# Altium schematic sheet ultrasound module1.0 - 改.SchDoc
size A4
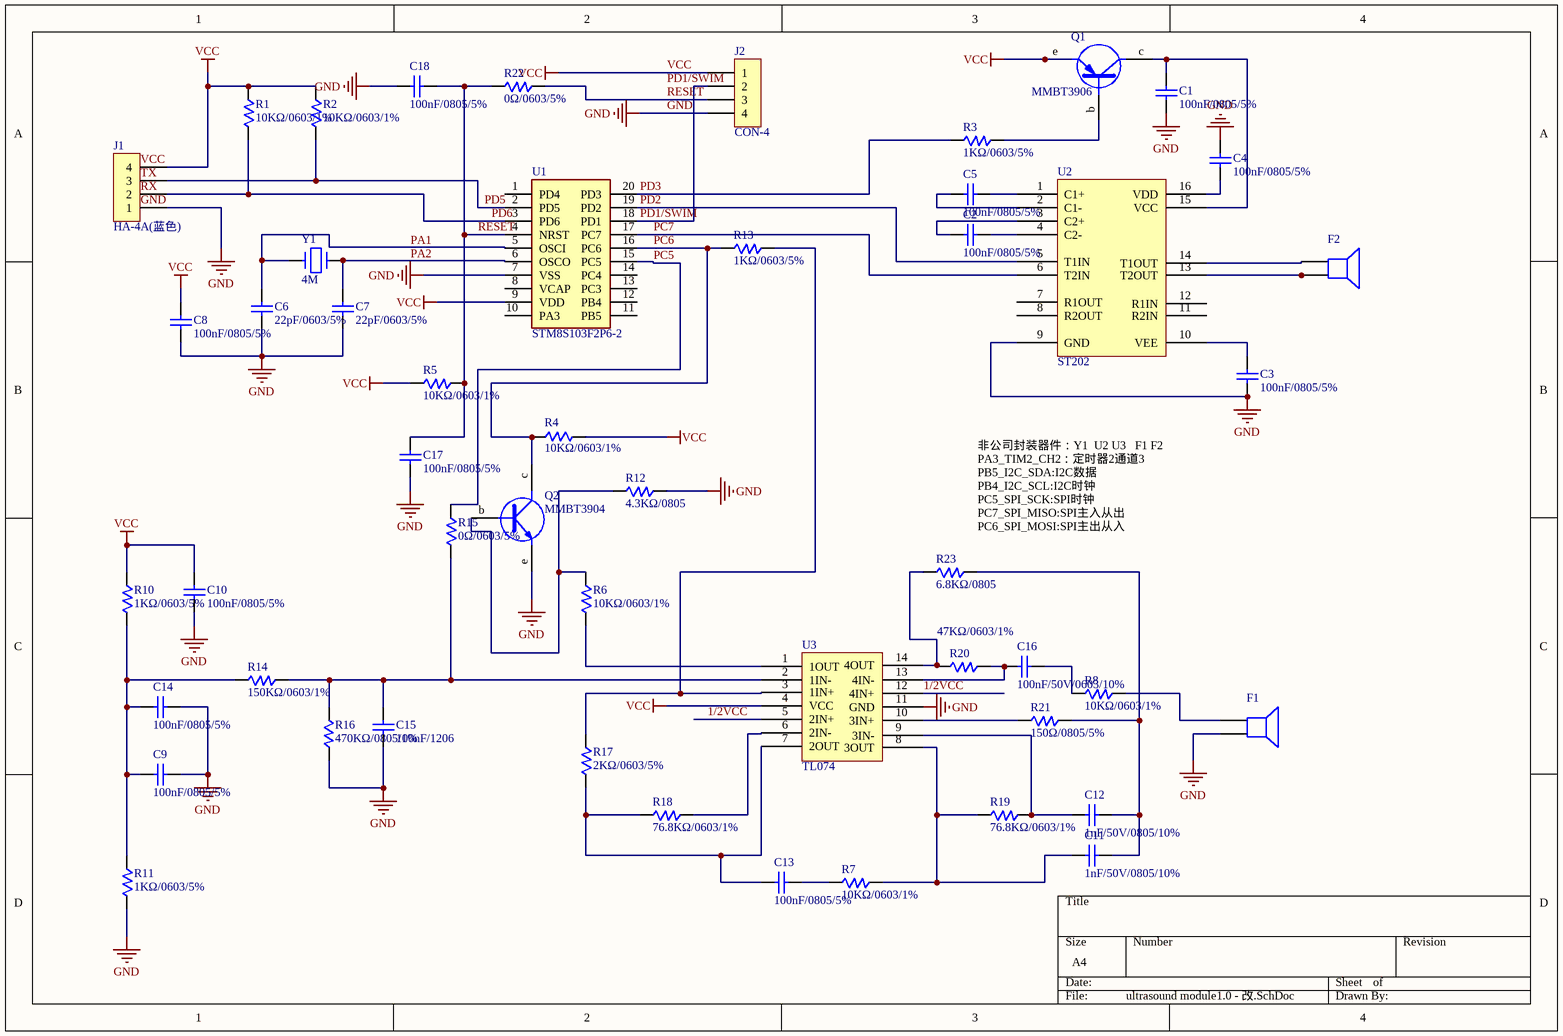
[diagram p0: ultrasound module1.0 - 改.SchDoc]

## Parts
C1  100nF/0805/5%  [0805C]
C2  100nF/0805/5%  [0805C]
C3  100nF/0805/5%  [0805C]
C4  100nF/0805/5%  [0805C]
C5  100nF/0805/5%  [0805C]
C6  22pF/0603/5%  [0603C]
C7  22pF/0603/5%  [0603C]
C8  100nF/0805/5%  [0805C]
C9  100nF/0805/5%  [0805C]
C10  100nF/0805/5%  [0805C]
C11  1nF/50V/0805/10%  [0805C]
C12  1nF/50V/0805/10%  [0805C]
C13  100nF/0805/5%  [0805C]
C14  100nF/0805/5%  [0805C]
C15  100nF/1206  [1206C]
C16  100nF/50V/0603/10%  [0603C]
C17  100nF/0805/5%  [0805C]
C18  100nF/0805/5%  [0805C]
F1  Speaker  [PIN2]  (value not drawn)
F2  Speaker  [PIN2]  (value not drawn)
J1  HA-4A(蓝色)  [HA-4A]
J2  CON-4  [HA-4A]
Q1  MMBT3906  [SOT-23B]
Q2  MMBT3904  [SOT-23B]
R1  10KΩ/0603/1%  [0603]
R2  10KΩ/0603/1%  [0603]
R3  1KΩ/0603/5%  [0603]
R4  10KΩ/0603/1%  [0603]
R5  10KΩ/0603/1%  [0603]
R6  10KΩ/0603/1%  [0603]
R7  10KΩ/0603/1%  [0603]
R8  10KΩ/0603/1%  [0603]
R10  1KΩ/0603/5%  [0603]
R11  1KΩ/0603/5%  [0603]
R12  4.3KΩ/0805  [0805]
R13  1KΩ/0603/5%  [0603]
R14  150KΩ/0603/1%  [0603]
R15  0Ω/0603/5%  [0603]
R16  470KΩ/0805/1%  [0805]
R17  2KΩ/0603/5%  [0603]
R18  76.8KΩ/0603/1%  [0603]
R19  76.8KΩ/0603/1%  [0603]
R20  47KΩ/0603/1%  [0603]
R21  150Ω/0805/5%  [0805]
R22  0Ω/0603/5%  [0603]
R23  6.8KΩ/0805  [0805]
U1  STM8S103F2P6-2  [TSSOP20]
U2  ST202  [ST202]
U3  TL074  [TL074]
Y1  4M  [SMD-49]

## Nets
GND: C1.1 C3.1 C4.2 C6.1 C7.1 C8.1 C9.1 C10.1 C14.1 C15.1 C17.1 C18.2 F1.2 J1.1 J2.4 Q2.e R11.1 R12.2 R16.2 U1.7(VSS) U2.9(GND) U3.11(GND)
VCC: C8.2 C10.2 J1.4 J2.1 Q1.e R1.2 R2.2 R4.1 R5.1 R10.2 U1.9(VDD) U3.4(VCC)
1/2VCC: U3.5(2IN+) U3.12(4IN+)
PC5: R15.2 U1.15(PC5)
PC6: Q2.c R4.2 R13.1 U1.16(PC6)
PC7: U1.17(PC7) U2.6(T2IN)
PD1/SWIM: J2.2 U1.18(PD1)
PD2: U1.19(PD2) U2.5(T1IN)
PD3: R3.1 U1.20(PD3)
PD5: J1.3 R2.1 U1.2(PD5)
PD6: J1.2 R1.1 U1.3(PD6)
RESET: C17.2 C18.1 J2.3 R5.2 R22.1 R22.2 U1.4(NRST)
NetC1_2: C1.2 Q1.c U2.15(VCC)
NetC2_1: C2.1 U2.3(C2+)
NetC2_2: C2.2 U2.4(C2-)
NetC3_2: C3.2 U2.10(VEE)
NetC4_1: C4.1 U2.16(VDD)
NetC5_1: C5.1 U2.2(C1-)
NetC5_2: C5.2 U2.1(C1+)
NetC6_2: C6.2 U1.5(OSCI) Y1.1
NetC7_2: C7.2 U1.6(OSCO) Y1.2
NetC9_2: C9.2 C14.2 R10.1 R11.2 R14.1
NetC11_1: C11.1 R7.2 R19.1 U3.8(3OUT)
NetC11_2: C11.2 C12.2 R21.2 R23.2
NetC12_1: C12.1 R19.2 U3.9(3IN-)
NetC13_1: C13.1 R17.1 R18.1 U3.7(2OUT)
NetC13_2: C13.2 R7.1
NetC15_2: C15.2 R14.2 R15.1 R16.1 U3.2(1IN-)
NetC16_1: C16.1 R8.1
NetC16_2: C16.2 R20.2 U3.13(4IN-)
NetF1_1: F1.1 R8.2
NetF2_1: F2.1 U2.14(T1OUT)
NetF2_2: F2.2 U2.13(T2OUT)
NetQ1_b: Q1.b R3.2
NetQ2_b: Q2.b R6.2 R12.1
NetR6_1: R6.1 U3.1(1OUT)
NetR13_2: R13.2 R17.2 U3.3(1IN+)
NetR18_2: R18.2 U3.6(2IN-)
NetR20_1: R20.1 R23.1 U3.14(4OUT)
NetR21_1: R21.1 U3.10(3IN+)

Not connected (* = marked no-connect by the designer): U1 1(PD4) 8(VCAP) 10(PA3) 11(PB5) 12(PB4) 13(PC3) 14(PC4); U2 7(R1OUT) 8(R2OUT) 11(R2IN) 12(R1IN); Y1 3(GND)

## Notes on the sheet
- (near R23) 非公司封装器件：Y1  U2 U3   F1 F2
  PA3_TIM2_CH2：定时器2通道3
  PB5_I2C_SDA:I2C数据
  PB4_I2C_SCL:I2C时钟
  PC5_SPI_SCK:SPI时钟
  PC7_SPI_MISO:SPI主入从出
  PC6_SPI_MOSI:SPI主出从入
- Labels drawn without touching a wire or pin: GND, PA1, PA2, PD1/SWIM, RX, TX, VCC

## Library data of the parts
C1-C5 C8-C10 C13 C14 C17 C18 = 贴片电容104J/100nF/50V/0805封装/5%/X7R/环保: 物料名称: 贴片电容104J/50V/0805封装/5%/X7R/环保; 物料编号: 1.01.25.002; 领料单位: 电子车间; 单位: 个; 仓库/库位: 内5X
C6 C7 = 贴片电容22PF/0603封装/精度5%/NPO/环保: 物料编号: 1.01.21.132; 领料单位: 电子车间; 单位: 个; 仓库/库位: 内5X; 物料名称: 贴片电容22PF/0603封装/精度5%/NPO/环保
C11 C12 = 贴片电容102/1nF/50V/0805封装/10%/N7R/环保: 物料名称: 贴片电容102/50V/0805封装/10%/N7R/环保; 物料编号: 1.01.25.020; 领料单位: 电子车间; 单位: 个; 仓库/库位: 内5X
C15 = 贴片电容104/100nF/1206封装/环保: 物料名称: 贴片电容104/1206封装/环保; 物料编号: 1.01.25.014; 领料单位: 电子车间; 单位: 个; 仓库/库位: 内5X
C16 = 贴片电容100nF（104M）/50V/0603封装/10%/X7R/环保: 物料编号: 1.01.25.056; 领料单位: 电子车间; 单位: 个; 仓库/库位: 内5X; 物料名称: 贴片电容100nF（104M）/50V/0603封装/10%/X7R/环保
F1 F2 = Speaker: Loudspeaker; Published: 24-Mar-1999; LatestRevisionDate: 17-Jul-2002; LatestRevisionNote: Re-released for DXP Platform.; PackageReference: PIN2; Publisher: Altium Limited
J1 = 带勾小直脚HA-4A(蓝色)/环保: 物料编号: 1.01.57.892; 领料单位: 电子车间; 单位: 个; 仓库/库位: 内5X; 物料名称: 带勾小直脚HA-4A(蓝色)/环保
J2 = 带勾小直脚HA-4A(白色)/环保: 物料编号: 1.01.57.884; 领料单位: 电子车间; 单位: 个; 仓库/库位: 内5X; 物料名称: 带勾小直脚HA-4A(白色)/环保
Q1 = 贴片三极管MMBT3906/sot-23/环保: 物料名称: 贴片三极管/MMBT3906/sot-23/环保; 物料编号: 1.01.33.012; 领料单位: 电子车间; 单位: 个; 仓库/库位: 内5X
Q2 = 贴片三极管1AM/MMBT3904/sot-23封装环保: 物料编号: 1.01.33.013; 领料单位: 电子车间; 单位: 个; 仓库/库位: 内5X; 物料名称: 贴片三极管1AM/MMBT3904/sot-23封装环保
R1 R2 R4-R8 = 贴片电阻10kΩ(1%)/0603封装/环保: 物料编号: 1.01.15.112; 领料单位: 电子车间; 单位: 个; 仓库/库位: 内5X; 物料名称: 贴片电阻10kΩ(1%)/0603封装/环保
R3 R10 R11 R13 = 贴片电阻1K/(5%)/0603封装/环保: 物料编号: 1.01.15.111; 领料单位: 电子车间; 单位: 个; 仓库/库位: 内5X; 物料名称: 贴片电阻1K/(5%)/0603封装/环保
R12 = 贴片电阻4.3KΩ/0805封装/环保: 物料编号: 1.01.15.053; 领料单位: 电子车间; 单位: 个; 仓库/库位: 内5X; 物料名称: 贴片电阻4.3KΩ/0805封装/环保
R14 = 贴片电阻150kΩ(1%)/0603封装/环保: 物料编号: 1.01.15.125; 领料单位: 电子车间; 单位: 个; 仓库/库位: 内5X; 物料名称: 贴片电阻150kΩ(1%)/0603封装/环保
R15 R22 = 贴片电阻0Ω/(5%)/0603封装/环保: 物料编号: 1.01.15.124; 领料单位: 电子车间; 单位: 个; 仓库/库位: 内5X; 物料名称: 贴片电阻0Ω/(5%)/0603封装/环保
R16 = 贴片电阻470KΩ/0805封装/1%精度/环保: 物料编号: 1.01.15.039; 领料单位: 电子车间; 单位: 个; 仓库/库位: 内5X; 物料名称: 贴片电阻470KΩ/0805封装/1%精度/环保
R17 = 贴片电阻2K/(5%)/0603封装/环保: 物料编号: 1.01.15.110; 领料单位: 电子车间; 单位: 个; 仓库/库位: 内5X; 物料名称: 贴片电阻2K/(5%)/0603封装/环保
R18 R19 = 贴片电阻76.8KΩ/0603封装/精度1%/环保: 物料编号: 1.01.15.140; 领料单位: 电子车间; 单位: 个; 仓库/库位: 内5X; 物料名称: 贴片电阻76.8KΩ/0603封装/精度1%/环保
R20 = 贴片电阻47K/1%/0603封装/环保: 物料编号: 1.01.15.148; 领料单位: 电子车间; 单位: 个; 仓库/库位: 内5X; 物料名称: 贴片电阻47K/1%/0603封装/环保
R21 = 贴片电阻150/(5%)/0805封装/环保: 物料编号: 1.01.15.128; 物料名称: 贴片电阻150R/(5%)/0805封装/环保; 领料单位: 电子车间; 单位: 个; 仓库/库位: 内5X
R23 = 贴片电阻6.8KΩ/0805封装/环保: 物料编号: 1.01.15.058; 领料单位: 电子车间; 单位: 个; 仓库/库位: 内5X; 物料名称: 贴片电阻6.8KΩ/0805封装/环保
U1 = 单片机STM8S103F2P6/TSSOP-20封装/环保_1: 物料编号: 1.01.45.569; 领料单位: 电子车间; 单位: 个; 仓库/库位: 内5X; 物料名称: 单片机STM8S103F2P6/TSSOP-20封装/环保
Y1 = 晶振48.0M/环保: 32.768KHz; 物料名称: 晶振4M